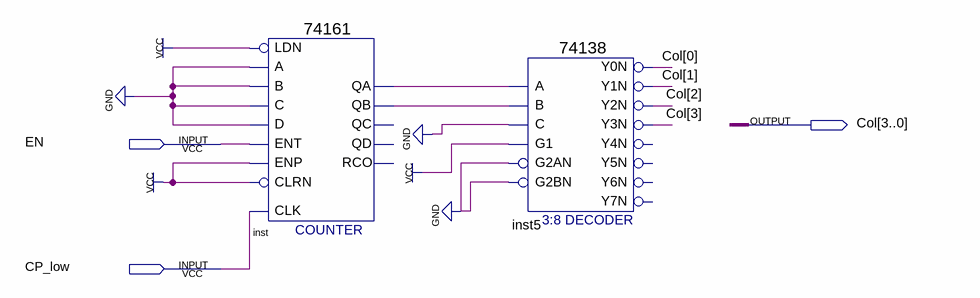
[diagram p0: schematic sheet]
// Quartus schematic Scanner.bdf as structural Verilog: 2 symbols, 3 pins
module Scanner (
  input  EN,
  input  CP_low,
  output [3:0] Col
);

  wire inst_qa, inst_qb;

  \74161  inst (
    .CLRN(1'b1), .CLK(CP_low), .ENP(1'b1), .LDN(1'b1), .A(1'b0), .D(1'b0), .ENT(EN), .B(1'b0), .C(1'b0),
    .QB(inst_qb), .QA(inst_qa));  // open: QD, QC, RCO
  \74138  inst5 (
    .A(inst_qa), .B(inst_qb), .G1(1'b1), .C(1'b0), .G2AN(1'b0), .G2BN(1'b0), .Y0N(Col[0]), .Y1N(Col[1]),
    .Y2N(Col[2]), .Y3N(Col[3]));  // open: Y4N, Y5N, Y6N, Y7N
endmodule
